# Altium schematic sheet STM32L031.SchDoc: STM32L031 MCU
size A4; DrawnBy: Dheeraj R; DocumentNumber: 4; Revision: 1; SheetNumber: 4; SheetTotal: 5
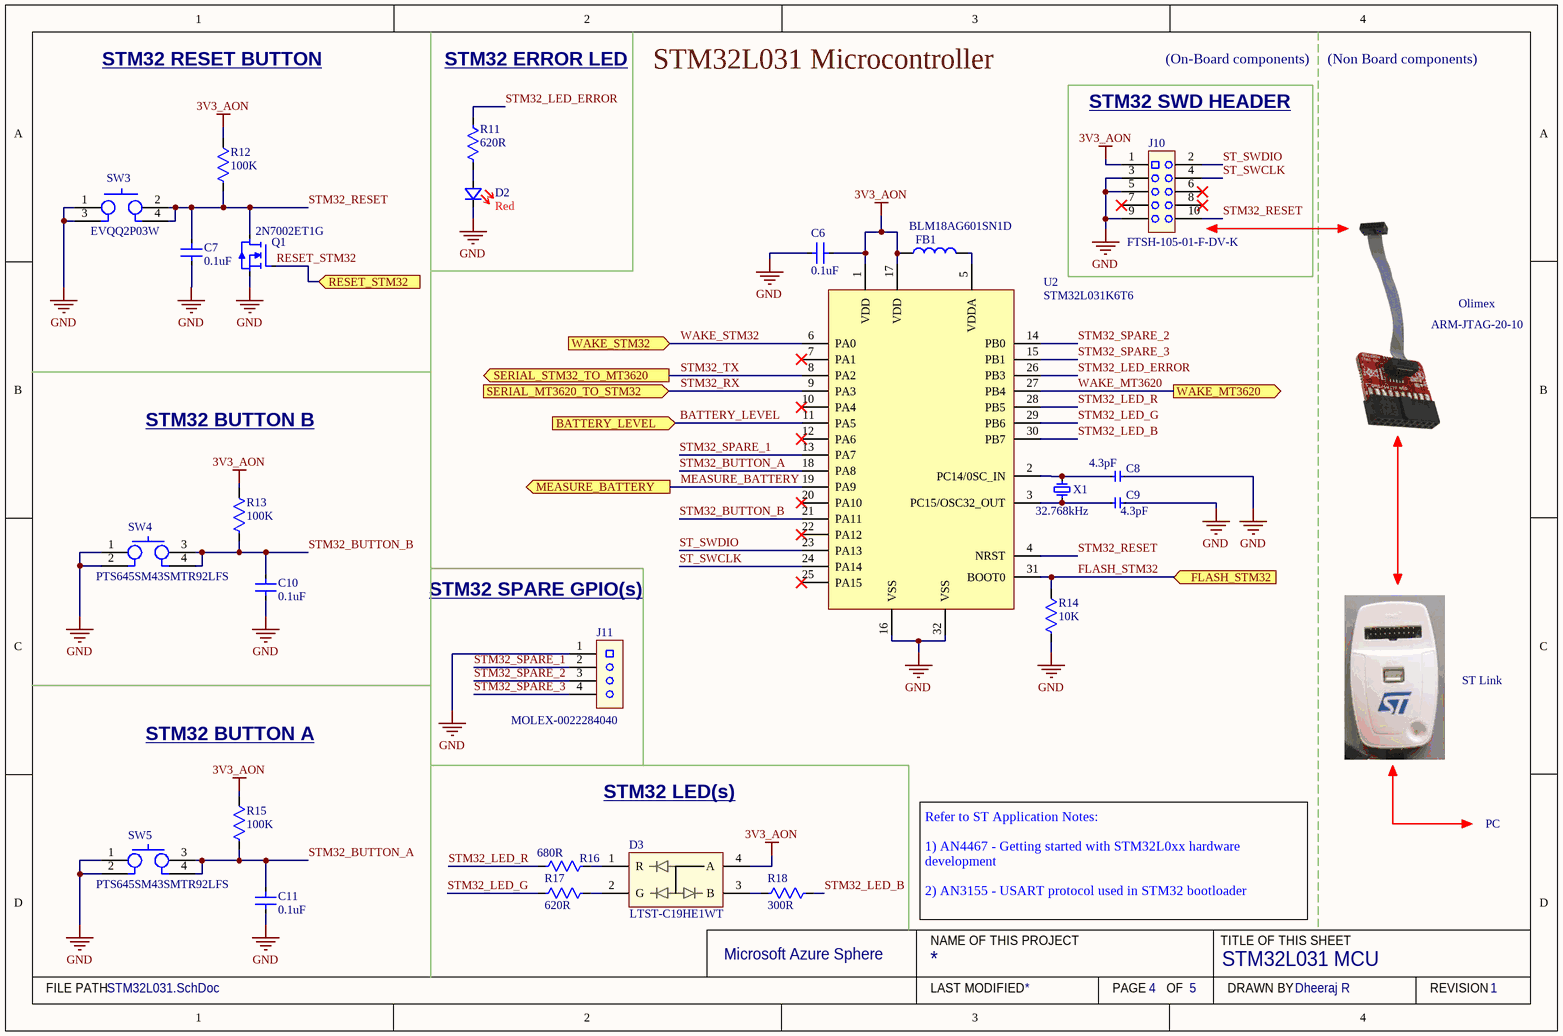
[diagram p0: STM32L031.SchDoc]

## Parts
C6  0.1uF  [CC0603]
C7  0.1uF  [CC0603]
C8  4.3pF  [CAP 0603 (1608) x 1.2mm]
C9  4.3pF  [CAP 0603 (1608) x 1.2mm]
C10  0.1uF  [CC0603]
C11  0.1uF  [CC0603]
D2  Colour: Red  [Rohm SML-D12 Red]  (hidden comment: SML-D12U)
D3  LTST-C19HE1WT  [LTST-C19HE1WT]
FB1  BLM18AG601SN1D  [BLM18P]
J10  FTSH-105-01-F-DV-K  [SAMTEC-FTSH-105-01-X-DV-K]
J11  MOLEX-0022284040  [0022284040]
Q1  2N7002ET1G  [SOT23-ONS]
R11  620R  [RC0603]
R12  100K  [VISHAY-0603]
R13  100K  [VISHAY-0603]
R14  10K  [VISHAY-0603]
R15  100K  [VISHAY-0603]
R16  680R  [RC0603]
R17  620R  [RC0603]
R18  300R  [RC0603]
SW3  SWI TACT SPN0 PANASONIC EVQQ2P03W  [EVQQ2P03W]  (value not drawn)
SW4  PTS645SM43SMTR92LFS  [C&K PTS645SM43SMTR92LFS]
SW5  PTS645SM43SMTR92LFS  [C&K PTS645SM43SMTR92LFS]
U2  STM32L031K6T6  [LQFP32-ST]
X1  32.768kHz  [XTAL_NX3215SA-00]

## Blocks framed on the sheet
STM32 SWD HEADER: J10

## Ports
BATTERY_LEVEL (in), FLASH_STM32 (in), MEASURE_BATTERY (out), RESET_STM32 (in), SERIAL_MT3620_TO_STM32 (in), SERIAL_STM32_TO_MT3620 (out), WAKE_MT3620 (out), WAKE_STM32 (in)

## Nets
3V3_AON: C6.2 D3.4(A) FB1.1 J10.1 R12.2 R13.2 R15.2 U2.1(VDD) U2.17(VDD)
GND: C6.1 C7.1 C8.1 C9.1 C10.1 C11.1 D2.1(K) J10.3 J10.5 J10.9 J11.1 Q1.2 R14.1 SW3.1 SW3.3 SW4.1 SW4.2 SW5.1 SW5.2 U2.16(VSS) U2.32(VSS)
BATTERY_LEVEL: U2.11(PA5) ; port BATTERY_LEVEL
FLASH_STM32: R14.2 U2.31(BOOT0) ; port FLASH_STM32
MEASURE_BATTERY: U2.19(PA9) ; port MEASURE_BATTERY
RESET_STM32: Q1.1 ; port RESET_STM32
ST_SWCLK: J10.4 U2.24(PA14)
ST_SWDIO: J10.2 U2.23(PA13)
STM32_BUTTON_A: C11.2 R15.1 SW5.3 SW5.4 U2.18(PA8)
STM32_BUTTON_B: C10.2 R13.1 SW4.3 SW4.4 U2.21(PA11)
STM32_LED_B: R18.2 U2.30(PB7)
STM32_LED_ERROR: R11.2 U2.26(PB3)
STM32_LED_G: R17.1 U2.29(PB6)
STM32_LED_R: R16.1 U2.28(PB5)
STM32_RESET: C7.2 J10.10 Q1.3 R12.1 SW3.2 SW3.4 U2.4(NRST)
STM32_RX: U2.9(PA3) ; port SERIAL_MT3620_TO_STM32
STM32_SPARE_1: J11.2 U2.13(PA7)
STM32_SPARE_2: J11.3 U2.14(PB0)
STM32_SPARE_3: J11.4 U2.15(PB1)
STM32_TX: U2.8(PA2) ; port SERIAL_STM32_TO_MT3620
WAKE_MT3620: U2.27(PB4) ; port WAKE_MT3620
WAKE_STM32: U2.6(PA0) ; port WAKE_STM32
NetC8_2: C8.2 U2.2(PC14/0SC_IN) X1.1
NetC9_2: C9.2 U2.3(PC15/OSC32_OUT) X1.2
NetD2_2: D2.2(A) R11.1
NetD3_1: D3.1(R) R16.2
NetD3_2: D3.2(G) R17.2
NetD3_3: D3.3(B) R18.1
NetFB1_2: FB1.2 U2.5(VDDA)

Not connected (* = marked no-connect by the designer): J10 6* 7* 8*; U2 7(PA1)* 10(PA4)* 12(PA6)* 20(PA10)* 22(PA12)* 25(PA15)*

## Notes on the sheet
- STM32 RESET BUTTON
- STM32 ERROR LED
- STM32L031 Microcontroller
- (On-Board components)
- (Non Board components)
- Olimex
- ARM-JTAG-20-10
- STM32 BUTTON B
- (near J11) STM32 SPARE GPIO(s)
- ST Link
- STM32 BUTTON A
- STM32 LED(s)
- PC
- Refer to ST Application Notes:
  1) AN4467 - Getting started with STM32L0xx hardware development
  2) AN3155 - USART protocol used in STM32 bootloader
  3) AN2606 - STM32 microcontroller system memory boot mode
- Microsoft Azure Sphere
- NAME OF THIS PROJECT
- TITLE OF THIS SHEET
- FILE PATH
- LAST MODIFIED
- PAGE
- OF
- DRAWN BY
- REVISION

## Library data of the parts
C6 C7 C10 C11 = CC0603KRX7R8BB104: 0.1uF, 0603, CC0603KRX7R8BB104, Yageo, 25V, X7R, 10%, FULL REEL; Capacitance: 100nF; Supplier 1: Digi-Key; Manufacturer: Yageo; Manufacturer Part Number: CC0603KRX7R8BB104; RoHS: Yes; Category: Ceramic Capacitors; Stock 1: 12615855; Pricing 1: 1=0.10000, 10=0.05300, 100=0.02340, 500=0.01674, 1000=0.01316 (USD); Mount: Surface Mount; Case/Package: 0603; Number of Pins: 2; Case Code (Imperial): 0603; Case Code (Metric): 1608; Min Operating Temperature: -55°C; Max Operating Temperature: 125°C; Tolerance: 10%; Dielectric: X7R; Voltage Rating: 25V; Packaging: Tape and Reel; Package Quantity: 1; Voltage Rating (DC): 25V; Termination: SMD/SMT; Composition: Ceramic; Voltage: 25V; Length: 1.6mm; Height: 0.8mm; Width: 0.8mm; Thickness: 0.035inch; Depth: 0.8mm; Radiation Hardening: No; REACH SVHC: Unknown; Lead Free: Lead Free; Halogen Free: Halogen Free; ComponentLink1URL: https://datasheet.ciiva.com/11786/0900766b80c10176-11786120.pdf?src-supplier=RSComponents; ComponentLink1Description: https://datasheet.ciiva.com/11786/0900766b80c10176-11786120.pdf?src-supplier=RSComponents; ComponentLink2URL: https://datasheet.ciiva.com/144/mlccorderingcode-144075.pdf?src-supplier=Digi-Key; ComponentLink2Description: https://datasheet.ciiva.com/144/mlccorderingcode-144075.pdf?src-supplier=Digi-Key; ComponentLink3URL: https://datasheet.ciiva.com/17434/upy-gphc-x7r-6-3v-to-50v-8-17434263.pdf?src-supplier=Avnet+Europe; ComponentLink3Description: https://datasheet.ciiva.com/17434/upy-gphc-x7r-6-3v-to-50v-8-17434263.pdf?src-supplier=Avnet+Europe; ComponentLink4URL: https://datasheet.ciiva.com/26829/getdatasheetpartid-403577-26829431.pdf?src-supplier=Verical; ComponentLink4Description: https://datasheet.ciiva.com/26829/getdatasheetpartid-403577-26829431.pdf?src-supplier=Verical; ComponentLink5URL: https://datasheet.ciiva.com/11587/upy-gphc-x7r-6-3v-to-50v-8-11587208.pdf?src-supplier=Avnet; ComponentLink5Description: https://datasheet.ciiva.com/11587/upy-gphc-x7r-6-3v-to-50v-8-11587208.pdf?src-supplier=Avnet; ComponentLink6URL: https://datasheet.ciiva.com/13389/upy-gphc-x7r-6-3v-to-50v-8-13389352.pdf?src-supplier=Mouser; ComponentLink6Description: https://datasheet.ciiva.com/13389/upy-gphc-x7r-6-3v-to-50v-8-13389352.pdf?src-supplier=Mouser; ComponentLink7URL: https://datasheet.ciiva.com/28450/1489800-28450584.pdf?src-supplier=Element14; ComponentLink7Description: https://datasheet.ciiva.com/28450/1489800-28450584.pdf?src-supplier=Element14; ComponentLink8URL: https://datasheet.ciiva.com/144/mlccorderingcode-144073.pdf?src-supplier=Digi-Key; ComponentLink8Description: https://datasheet.ciiva.com/144/mlccorderingcode-144073.pdf?src-supplier=Digi-Key; ComponentLink9URL: https://datasheet.ciiva.com/144/mlccorderingcode-144074.pdf?src-supplier=Digi-Key; ComponentLink9Description: https://datasheet.ciiva.com/144/mlccorderingcode-144074.pdf?src-supplier=Digi-Key; ComponentLink10URL: https://datasheet.ciiva.com/7978/1489800-7978155.pdf?src-supplier=Element14; ComponentLink10Description: https://datasheet.ciiva.com/7978/1489800-7978155.pdf?src-supplier=Element14; Supplier Part Number 1: 311-1341-1-ND
C8 C9 = 4.3pF 0603 CL10C4R3CB8NNNC: 4.3PF 50V C0G/NP0 0603; Manufacturer: Samsung; Dielectric: C0G; Supplier 1: Digi-Key; Manufacturer Part Number: CL10C4R3CB8NNNC; RoHS: Yes; Category: Ceramic Capacitors; Stock 1: 15793; Pricing 1: 1=0.10000, 10=0.06300, 100=0.02810, 500=0.02010, 1000=0.01579 (USD); Mount: Surface Mount; Case/Package: 0603; Case Code (Metric): 1608; Case Code (Imperial): 0603; Min Operating Temperature: -55°C; Max Operating Temperature: 125°C; Capacitance: 4.3pF; Voltage Rating: 50V; Package Quantity: 1; Packaging: Tape and Reel; Voltage Rating (DC): 50V; Length: 1.6mm; Height: 0.8mm; Width: 0.031inch; Thickness: 0.035inch; Depth: 0.8mm; Radiation Hardening: No; Lead Free: Lead Free; ComponentLink1URL: https://datasheet.ciiva.com/16200/cl10c4r3cb8nnnc-16200048.pdf?src-supplier=Future+Electronics; ComponentLink1Description: https://datasheet.ciiva.com/16200/cl10c4r3cb8nnnc-16200048.pdf?src-supplier=Future+Electronics; ComponentLink2URL: https://datasheet.ciiva.com/25778/cl10c4r3cb8nnnc-25778560.pdf?src-supplier=Digi-Key; ComponentLink2Description: https://datasheet.ciiva.com/25778/cl10c4r3cb8nnnc-25778560.pdf?src-supplier=Digi-Key; ComponentLink3URL: https://datasheet.ciiva.com/26838/getdatasheetpartid-660050-26838544.pdf?src-supplier=Verical; ComponentLink3Description: https://datasheet.ciiva.com/26838/getdatasheetpartid-660050-26838544.pdf?src-supplier=Verical; Supplier Part Number 1: 1276-2309-1-ND
D2 = SML-D12U: 1.6 x 0.8 x 0.55mm (0603) LED 620nm Red; Manufacturer: Rohm Semiconductor; Manufacturer Part Number: SML-D12U8WT86; Millicandela Rating: 63mcd; Voltage - Forward (Vf) (Typ): 2.2V; Current - Test: 20mA; Lens Type: Diffused, White; Lens Style/Size: Rectangle with Flat Top, 1.2mm x 0.8mm; Supplier 1: Digi-Key; RoHS: RoHS Compliant; Category: Optoelectronics; Stock 1: 5722; Pricing 1: 1=0.38, 10=0.279, 25=0.2232, 100=0.1478, 250=0.1046, 500=0.08926, 1000=0.06974 (GBP); Packaging: Cut Tape (CT); Wavelength - Dominant: 620nm; Wavelength - Peak: -; Viewing Angle: -; Package / Case: 0603 (1608 Metric); Size / Dimension: 1.60mm L x 0.80mm W; Height: 0.55mm; Mounting Type: Surface Mount; Luminous Flux @ Current - Test: -; ComponentLink1URL: http://rohmfs.rohm.com/en/products/databook/datasheet/opto/led/chip_mono/sml-d1.pdf; ComponentLink1Description: http://rohmfs.rohm.com/en/products/databook/datasheet/opto/led/chip_mono/sml-d1.pdf; Supplier 2: Farnell; Supplier Part Number 1: 511-1580-1-ND; Supplier Part Number 2: 1685094
D3 = LTST-C19HE1WT: LED RGB DIFFUSED 0606 SMD; Manufacturer: Lite-On Inc.; Color: Red, Green, Blue (RGB); Lens Color: White; Millicandela Rating: 112.5mcd Red, 281mcd Green, 104mcd Blue; Lens Style/Size: Rectangle with Flat Top, 1.15mm x 1.60mm; Voltage - Forward (Vf) (Typ): 2.1V Red, 3.35V Green, 3.35V Blue; Current - Test: 20mA Red, 20mA Green, 20mA Blue; Viewing Angle: 130°; Wavelength - Dominant: 624nm Red, 525nm Green, 470nm Blue; Wavelength - Peak: 632nm Red, 520nm Green, 468nm Blue; Supplier 1: Digi-Key; Manufacturer Part Number: LTST-C19HE1WT; RoHS: RoHS Compliant; Category: Optoelectronics; Stock 1: 464778; Pricing 1: 1=0.45, 10=0.32, 25=0.2616, 100=0.2093, 250=0.17664, 500=0.15048, 1000=0.11776 (GBP); Packaging: Cut Tape (CT); Part Status: Active; Lens Transparency: Diffused; Mounting Type: Surface Mount; Features: -; Package / Case: 0606 (1616 Metric); Supplier Device Package: *; Size / Dimension: 1.60mm L x 1.60mm W; Height (Max): 0.35mm; ComponentLink1URL: http://optoelectronics.liteon.com/upload/download/DS22-2008-0044/S_110_LTST-C19HE1WT.pdf; ComponentLink1Description: http://optoelectronics.liteon.com/upload/download/DS22-2008-0044/S_110_LTST-C19HE1WT.pdf; Supplier Part Number 1: 160-2162-1-ND
FB1 = BLM18AG601SN1D: MURATA - BLM18AG601SN1D - Feritový Korálek, 0603 / 1608, 600 ohm, 500 mA, Série BLM18A, 0.38 ohm, ± 25%; Core Material: Ferrite; Material: Steel,Ferrite; Impedance: 600R; Max Current Rating: 500mA; Number of Lines: 1; DC Resistance (DCR): 380mR; Test Frequency: 100MHz; Shielding: Unshielded; Supplier 1: Digi-Key; Manufacturer: Murata; Manufacturer Part Number: BLM18AG601SN1D; RoHS: Yes; Category: Inductors; Stock 1: 351346; Pricing 1: 1=0.10000, 10=0.07900, 25=0.07200, 50=0.06480, 100=0.04760, 250=0.03460, 500=0.03170, 1000=0.02738 (USD); Case/Package: 0603; Number of Pins: 2; Weight: 7.1E-05oz; Case Code (Metric): 1608; Case Code (Imperial): 0603; Min Operating Temperature: -55°C; Max Operating Temperature: 125°C; Tolerance: 25%; Package Quantity: 1; Packaging: Tape and Reel; Current Rating: 500mA; Termination: SMD/SMT; Max DC Current: 500mA; DC Current: 500mA; Military Standard: Not; Frequency: 100MHz; Number of Circuits: 1; Length: 1.6mm; Height: 0.8mm; Width: 0.8mm; Depth: 0.8mm; Radiation Hardening: No; REACH SVHC: No SVHC; Lead Free: Lead Free; ComponentLink1URL: https://datasheet.ciiva.com/19460/1844766-19460213.pdf?src-supplier=Jameco; ComponentLink1Description: https://datasheet.ciiva.com/19460/1844766-19460213.pdf?src-supplier=Jameco; ComponentLink2URL: https://datasheet.ciiva.com/29347/442309-da-01-en-chip-drossel-0603-600r-500ma-1-6x0-8mm-29347900.pdf?src-supplier=Conrad; ComponentLink2Description: https://datasheet.ciiva.com/29347/442309-da-01-en-chip-drossel-0603-600r-500ma-1-6x0-8mm-29347900.pdf?src-supplier=Conrad; ComponentLink3URL: https://datasheet.ciiva.com/41449/001172228-da-01-en-drossel-0603-600r-1-6x0-8mm-4000st-41449517.pdf?src-supplier=Conrad; ComponentLink3Description: https://datasheet.ciiva.com/41449/001172228-da-01-en-drossel-0603-600r-1-6x0-8mm-4000st-41449517.pdf?src-supplier=Conrad; ComponentLink4URL: https://datasheet.ciiva.com/1012/l0110s0100blm18a-1012017.pdf?src-supplier=Digi-Key; ComponentLink4Description: https://datasheet.ciiva.com/1012/l0110s0100blm18a-1012017.pdf?src-supplier=Digi-Key; ComponentLink5URL: https://datasheet.ciiva.com/1012/l0110s0100blm18a-1012018.pdf?src-supplier=Digi-Key; ComponentLink5Description: https://datasheet.ciiva.com/1012/l0110s0100blm18a-1012018.pdf?src-supplier=Digi-Key; ComponentLink6URL: https://datasheet.ciiva.com/1012/l0110s0100blm18a-1012019.pdf?src-supplier=Digi-Key; ComponentLink6Description: https://datasheet.ciiva.com/1012/l0110s0100blm18a-1012019.pdf?src-supplier=Digi-Key; ComponentLink7URL: https://datasheet.ciiva.com/1466/1756147-1466933.pdf?src-supplier=Element14; ComponentLink7Description: https://datasheet.ciiva.com/1466/1756147-1466933.pdf?src-supplier=Element14; ComponentLink8URL: https://datasheet.ciiva.com/1466/1756147-1466934.pdf?src-supplier=Element14; ComponentLink8Description: https://datasheet.ciiva.com/1466/1756147-1466934.pdf?src-supplier=Element14; ComponentLink9URL: https://datasheet.ciiva.com/16210/l0110s0100blm18a-16210006.pdf?src-supplier=Future+Electronics; ComponentLink9Description: https://datasheet.ciiva.com/16210/l0110s0100blm18a-16210006.pdf?src-supplier=Future+Electronics; ComponentLink10URL: https://datasheet.ciiva.com/3081/l0110s0100blm18a-3081613.pdf?src-supplier=Avnet; ComponentLink10Description: https://datasheet.ciiva.com/3081/l0110s0100blm18a-3081613.pdf?src-supplier=Avnet; Supplier Part Number 1: 490-1014-1-ND
J10 = FTSH-105-01-F-DV-K: CONN HEADER 10POS DUAL .05" SMD; Manufacturer: Samtec Inc.; Connector Type: Header, Unshrouded; Number of Positions: 10; Number of Positions Loaded: All; Pitch: 0.050" (1.27mm); Supplier 1: Digi-Key; Manufacturer Part Number: FTSH-105-01-F-DV-K; RoHS: RoHS Compliant; Category: Connectors, Interconnects; Stock 1: 13304; Pricing 1: 1=2.26, 10=1.907, 50=1.647, 100=1.4737, 250=1.30032, 500=1.21362, 1000=1.12693, 2500=1.08358, 5000=1.06191 (GBP); Packaging: Tube; Contact Type: Male Pin; Number of Rows: 2; Row Spacing: 0.050" (1.27mm); Contact Mating Length: 0.120" (3.05mm); Mounting Type: Surface Mount; Termination: Solder; Fastening Type: -; Features: Keying Shroud; Contact Finish: Gold; Contact Finish Thickness: 3µin (0.08µm); Color: Black; ComponentLink1URL: http://suddendocs.samtec.com/prints/ftsh-1xx-xx-xxx-dv-xxx-mkt.pdf; ComponentLink1Description: http://suddendocs.samtec.com/prints/ftsh-1xx-xx-xxx-dv-xxx-mkt.pdf; Supplier Part Number 1: SAM8796-ND
J11 = MOLEX-0022284040: CONN HEADER 4POS .100 VERT TIN; Manufacturer: Molex, LLC; Connector Type: Header, Unshrouded, Breakaway; Number of Positions: 4; Number of Positions Loaded: All; Pitch: 0.100" (2.54mm); Supplier 1: Digi-Key; Manufacturer Part Number: 0022284040; RoHS: RoHS Compliant; Category: Connectors, Interconnects; Stock 1: 1330; Pricing 1: 1=0.15, 10=0.144, 25=0.1228, 50=0.1074, 100=0.0999, 250=0.08836, 500=0.0845 (GBP); Packaging: Bulk; Contact Type: Male Pin; Number of Rows: 1; Row Spacing: -; Contact Mating Length: 0.240" (6.10mm); Mounting Type: Through Hole; Termination: Solder; Fastening Type: -; Features: -; Contact Finish: Tin; Contact Finish Thickness: 100µin (2.54µm); Color: Black; ComponentLink1URL: http://www.molex.com/pdm_docs/sd/022284040_sd.pdf; ComponentLink1Description: http://www.molex.com/pdm_docs/sd/022284040_sd.pdf; Supplier Part Number 1: WM50014-04-ND
Q1 = 2N7002ET1G: N-CH 60V 0.26A 3-Pin SOT-23 T/R; Manufacturer: ON Semiconductor; Continuous Drain Current (ID): 260mA; Turn-Off Delay Time: 4.8ns; Turn-On Delay Time: 1.7ns; Gate to Source Voltage (Vgs): 20V; Rds On Max: 2.5R; Input Capacitance: 26.7pF; Rise Time: 1.2ns; Max Power Dissipation: 300mW; Element Configuration: Single; Nominal Vgs: 1V; Number of Elements: 1; Supplier 1: Digi-Key; Manufacturer Part Number: 2N7002ET1G; RoHS: Yes; Category: MOSFETs; Stock 1: 23546; Pricing 1: 1=0.18000, 10=0.16300, 25=0.15520, 100=0.06820, 250=0.06548, 500=0.05356, 1000=0.03720 (USD); Case/Package: SOT-23-3; Number of Pins: 3; Min Operating Temperature: -55°C; Max Operating Temperature: 150°C; Package Quantity: 3000; Packaging: Tape and Reel; Fall Time: 1.2ns; Drain to Source Resistance: 2.5R; On-State Resistance: 2.5R; Drain to Source Breakdown Voltage: 60V; Power Dissipation: 300mW; Threshold Voltage: 1V; Length: 2.9mm; Height: 0.94mm; Width: 1.3mm; Radiation Hardening: No; Lead Free: Lead Free; REACH SVHC: No SVHC; Halogen Free: Halogen Free; ComponentLink1URL: https://datasheet.ciiva.com/936/2n7002e-d-936787.pdf?src-supplier=Digi-Key; ComponentLink1Description: https://datasheet.ciiva.com/936/2n7002e-d-936787.pdf?src-supplier=Digi-Key; ComponentLink2URL: https://datasheet.ciiva.com/8059/2n7002e-d-8059427.pdf?src-supplier=Element14; ComponentLink2Description: https://datasheet.ciiva.com/8059/2n7002e-d-8059427.pdf?src-supplier=Element14; ComponentLink3URL: https://datasheet.ciiva.com/13060/2n7002e-d-105476-13060091.pdf?src-supplier=Mouser; ComponentLink3Description: https://datasheet.ciiva.com/13060/2n7002e-d-105476-13060091.pdf?src-supplier=Mouser; ComponentLink4URL: https://datasheet.ciiva.com/936/2n7002e-d-936788.pdf?src-supplier=Digi-Key; ComponentLink4Description: https://datasheet.ciiva.com/936/2n7002e-d-936788.pdf?src-supplier=Digi-Key; ComponentLink5URL: https://datasheet.ciiva.com/936/2n7002e-d-936789.pdf?src-supplier=Digi-Key; ComponentLink5Description: https://datasheet.ciiva.com/936/2n7002e-d-936789.pdf?src-supplier=Digi-Key; ComponentLink6URL: https://datasheet.ciiva.com/3304/2n7002e-d-3304389.pdf?src-supplier=Avnet; ComponentLink6Description: https://datasheet.ciiva.com/3304/2n7002e-d-3304389.pdf?src-supplier=Avnet; ComponentLink7URL: https://datasheet.ciiva.com/3304/2n7002e-d-3304390.pdf?src-supplier=Avnet; ComponentLink7Description: https://datasheet.ciiva.com/3304/2n7002e-d-3304390.pdf?src-supplier=Avnet; ComponentLink8URL: https://datasheet.ciiva.com/15198/getdatasheetpartid-53846-15198758.pdf?src-supplier=Verical; ComponentLink8Description: https://datasheet.ciiva.com/15198/getdatasheetpartid-53846-15198758.pdf?src-supplier=Verical; ComponentLink9URL: https://datasheet.ciiva.com/26146/2n7002e-d-26146200.pdf?src-supplier=Avnet+Europe; ComponentLink9Description: https://datasheet.ciiva.com/26146/2n7002e-d-26146200.pdf?src-supplier=Avnet+Europe; ComponentLink10URL: https://datasheet.ciiva.com/49018/70339334-49018202.pdf?src-supplier=Allied+Electronics; ComponentLink10Description: https://datasheet.ciiva.com/49018/70339334-49018202.pdf?src-supplier=Allied+Electronics; ComponentLink11URL: https://datasheet.ciiva.com/22641/1708226-22641627.pdf?src-supplier=Element14; ComponentLink11Description: https://datasheet.ciiva.com/22641/1708226-22641627.pdf?src-supplier=Element14; ComponentLink12URL: https://datasheet.ciiva.com/16305/2n7002e-d-16305452.pdf?src-supplier=Future+Electronics; ComponentLink12Description: https://datasheet.ciiva.com/16305/2n7002e-d-16305452.pdf?src-supplier=Future+Electronics; ComponentLink13URL: https://datasheet.ciiva.com/22641/1708226-22641628.pdf?src-supplier=Element14; ComponentLink13Description: https://datasheet.ciiva.com/22641/1708226-22641628.pdf?src-supplier=Element14; Supplier Part Number 1: 2N7002ET1GOSCT-ND
R11 R17 = RC0603FR-07620RL: 620 Ohm, 0603, 1% 0.1W(1/10W) 100ppm/ C Molded SMD Paper T/R; Manufacturer: Yageo; Power Rating: 100mW; Voltage Rating: 75V; Temperature Coefficient: 100ppm/°C; Voltage Rating (DC): 50V; Supplier 1: Digi-Key; Manufacturer Part Number: RC0603FR-07620RL; RoHS: Yes; Category: Chip SMD Resistors; Stock 1: 488; Pricing 1: 1=0.10000, 10=0.02300, 100=0.00940, 1000=0.00421, 2500=0.00366 (USD); Case/Package: 0603; Weight: 7.1E-05oz; Case Code (Imperial): 0603; Case Code (Metric): 1608; Min Operating Temperature: -55°C; Max Operating Temperature: 155°C; Resistance: 620R; Tolerance: 1%; Packaging: Tape and Reel; Termination: SMD/SMT; Composition: Thick Film; Military Standard: Not; Length: 1.6mm; Height: 0.45mm; Width: 0.8mm; Depth: 0.8mm; Lead Free: Lead Free; ComponentLink1URL: http://components.arrow.com/part/dataview/0323_00047453?src-supplier=Arrow+Europe; ComponentLink1Description: http://components.arrow.com/part/dataview/0323_00047453?src-supplier=Arrow+Europe; ComponentLink2URL: http://www.mouser.com/ds/2/447/RC0603-272842.pdf?src-supplier=Mouser; ComponentLink2Description: http://www.mouser.com/ds/2/447/RC0603-272842.pdf?src-supplier=Mouser; ComponentLink3URL: http://www.yageo.com/documents/recent/PYu-RC_Group_51_RoHS_L_10.pdf?src-supplier=Digi-Key; ComponentLink3Description: http://www.yageo.com/documents/recent/PYu-RC_Group_51_RoHS_L_10.pdf?src-supplier=Digi-Key; ComponentLink4URL: http://www.yageo.com/documents/recent/PYu-RC0603_51_RoHS_L_7.pdf?src-supplier=Future+Electronics; ComponentLink4Description: http://www.yageo.com/documents/recent/PYu-RC0603_51_RoHS_L_7.pdf?src-supplier=Future+Electronics; ComponentLink5URL: http://www.yageo.com/documents/recent/PYu-RC_Group_51_RoHS_L_9.pdf?src-supplier=Digi-Key; ComponentLink5Description: http://www.yageo.com/documents/recent/PYu-RC_Group_51_RoHS_L_9.pdf?src-supplier=Digi-Key; Supplier Part Number 1: 311-620HRCT-ND
R12 R13 R15 = RC0603FR-07100KL: 100K Ohm 0603 1% 0.1W(1/10W) 100ppm Paper T/R; Manufacturer: Yageo; Resistance: 100kR; Temperature Coefficient: 100ppm/°C; Voltage Rating (DC): 50V; Power Rating: 100mW; Working Voltage: 75V; Supplier 1: Digi-Key; Manufacturer Part Number: RC0603FR-07100KL; RoHS: Yes; Category: Chip SMD Resistors; Stock 1: 18400350; Pricing 1: 1=0.10000, 10=0.02300, 100=0.00940, 1000=0.00421, 2500=0.00366 (USD); Case/Package: 0603; Number of Pins: 2; Case Code (Imperial): 0603; Case Code (Metric): 1608; Min Operating Temperature: -55°C; Max Operating Temperature: 155°C; Tolerance: 1%; Composition: Thick Film; Packaging: Tape and Reel; Voltage Rating: 50V; Termination: SMD/SMT; Military Standard: Not; Number of Terminations: 2; Length: 1.6mm; Height: 0.45mm; Width: 0.8mm; Depth: 0.8mm; REACH SVHC: No SVHC; Lead Free: Lead Free; ComponentLink1URL: https://datasheet.ciiva.com/11808/0900766b80f96399-11808107.pdf?src-supplier=RSComponents; ComponentLink1Description: https://datasheet.ciiva.com/11808/0900766b80f96399-11808107.pdf?src-supplier=RSComponents; ComponentLink2URL: https://datasheet.ciiva.com/7983/443971-7983593.pdf?src-supplier=Element14; ComponentLink2Description: https://datasheet.ciiva.com/7983/443971-7983593.pdf?src-supplier=Element14; ComponentLink3URL: https://datasheet.ciiva.com/46440/1868787-46440889.pdf?src-supplier=Element14; ComponentLink3Description: https://datasheet.ciiva.com/46440/1868787-46440889.pdf?src-supplier=Element14; ComponentLink4URL: https://datasheet.ciiva.com/7746/1738695-7746234.pdf?src-supplier=Element14; ComponentLink4Description: https://datasheet.ciiva.com/7746/1738695-7746234.pdf?src-supplier=Element14; ComponentLink5URL: https://datasheet.ciiva.com/7746/1738695-7746235.pdf?src-supplier=Element14; ComponentLink5Description: https://datasheet.ciiva.com/7746/1738695-7746235.pdf?src-supplier=Element14; ComponentLink6URL: https://datasheet.ciiva.com/22747/443971-22747516.pdf?src-supplier=Element14; ComponentLink6Description: https://datasheet.ciiva.com/22747/443971-22747516.pdf?src-supplier=Element14; Supplier Part Number 1: 311-100KHRCT-ND
R14 = RC0603FR-0710KL: 10K Ohm 0603 1% 1/10W ±100ppm/°C Molded SMD Paper T/R; Manufacturer: Yageo; Resistance: 10kR; Voltage Rating (DC): 50V; Power Rating: 100mW; Voltage Rating: 75V; Supplier 1: Farnell; Manufacturer Part Number: RC0603FR-0710KL; RoHS: Yes; Category: Chip SMD Resistors; Stock 1: 650865; Pricing 1: 10=0.01950, 100=0.01660, 500=0.01160, 1000=0.00890, 2500=0.00660 (GBP); Case/Package: 0603; Number of Pins: 2; Weight: 7.1E-05oz; Case Code (Imperial): 0603; Case Code (Metric): 1608; Min Operating Temperature: -55°C; Max Operating Temperature: 155°C; Tolerance: 1%; Composition: Thick Film; Temperature Coefficient: 100ppm/°C; Packaging: Tape and Reel; Military Standard: Not; Termination: SMD/SMT; Length: 1.6mm; Height: 0.45mm; Width: 0.8mm; Depth: 0.8mm; Lead Pitch: 0.3mm; REACH SVHC: No SVHC; Lead Free: Lead Free; ComponentLink1URL: https://datasheet.ciiva.com/7660/38590-7660789.pdf?src-supplier=Element14; ComponentLink1Description: https://datasheet.ciiva.com/7660/38590-7660789.pdf?src-supplier=Element14; ComponentLink2URL: https://datasheet.ciiva.com/15189/getdatasheetpartid-409289-15189591.pdf?src-supplier=Verical; ComponentLink2Description: https://datasheet.ciiva.com/15189/getdatasheetpartid-409289-15189591.pdf?src-supplier=Verical; ComponentLink3URL: https://datasheet.ciiva.com/46440/1868787-46440891.pdf?src-supplier=Element14; ComponentLink3Description: https://datasheet.ciiva.com/46440/1868787-46440891.pdf?src-supplier=Element14; ComponentLink4URL: https://datasheet.ciiva.com/7983/443971-7983596.pdf?src-supplier=Element14; ComponentLink4Description: https://datasheet.ciiva.com/7983/443971-7983596.pdf?src-supplier=Element14; ComponentLink5URL: https://datasheet.ciiva.com/7746/1738695-7746239.pdf?src-supplier=Element14; ComponentLink5Description: https://datasheet.ciiva.com/7746/1738695-7746239.pdf?src-supplier=Element14; ComponentLink6URL: https://datasheet.ciiva.com/22747/443971-22747519.pdf?src-supplier=Element14; ComponentLink6Description: https://datasheet.ciiva.com/22747/443971-22747519.pdf?src-supplier=Element14; Supplier Part Number 1: 9238603
R16 = RC0603FR-07680RL: 680R, 0603 YAGEO - RC0603FR-07680RL - SMD Chip Resistor, RC Series, 50 V, Thick Film, 100 mW; Tolerance: 1%; Temperature Coefficient: 100ppm/°C; Voltage Rating (DC): 50V; Power Rating: 100mW; Supplier 1: Digi-Key; Manufacturer: Yageo; Manufacturer Part Number: RC0603FR-07680RL; RoHS: Yes; Category: Chip SMD Resistors; Stock 1: 2382438; Pricing 1: 1=0.10000, 10=0.02300, 100=0.00940, 1000=0.00421, 2500=0.00366 (USD); Case/Package: 0603; Number of Pins: 2; Case Code (Imperial): 0603; Case Code (Metric): 1608; Min Operating Temperature: -55°C; Max Operating Temperature: 155°C; Resistance: 680R; Composition: Thick Film; Packaging: Tape and Reel; Number of Terminations: 2; Military Standard: Not; Voltage Rating: 50V; Package Quantity: 1; Max Power Dissipation: 100mW; Features: Moisture Resistant; Termination: SMD/SMT; Length: 1.6mm; Height: 0.022inch; Width: 0.031inch; Depth: 0.8mm; REACH SVHC: No SVHC; Lead Free: Lead Free; ComponentLink1URL: https://datasheet.ciiva.com/2553/pyu-r-int-thick-7-2553546.pdf?src-supplier=Digi-Key; ComponentLink1Description: https://datasheet.ciiva.com/2553/pyu-r-int-thick-7-2553546.pdf?src-supplier=Digi-Key; ComponentLink2URL: https://datasheet.ciiva.com/7746/443971-7746389.pdf?src-supplier=Element14; ComponentLink2Description: https://datasheet.ciiva.com/7746/443971-7746389.pdf?src-supplier=Element14; ComponentLink3URL: https://datasheet.ciiva.com/46412/443971-46412854.pdf?src-supplier=Element14; ComponentLink3Description: https://datasheet.ciiva.com/46412/443971-46412854.pdf?src-supplier=Element14; ComponentLink4URL: https://datasheet.ciiva.com/2553/pyu-r-int-thick-7-2553545.pdf?src-supplier=Digi-Key; ComponentLink4Description: https://datasheet.ciiva.com/2553/pyu-r-int-thick-7-2553545.pdf?src-supplier=Digi-Key; ComponentLink5URL: https://datasheet.ciiva.com/2553/pyu-r-int-thick-7-2553547.pdf?src-supplier=Digi-Key; ComponentLink5Description: https://datasheet.ciiva.com/2553/pyu-r-int-thick-7-2553547.pdf?src-supplier=Digi-Key; Supplier Part Number 1: 311-680HRCT-ND
R18 = RC0603FR-07300RL: 300 Ohm, 0603, 1% 0.1W(1/10W) 100ppm/ C Molded SMD Paper T/R; Manufacturer: Yageo; Power Rating: 100mW; Voltage Rating: 50V; Temperature Coefficient: 100ppm/°C; Working Voltage: 75V; Supplier 1: Digi-Key; Manufacturer Part Number: RC0603FR-07300RL; RoHS: Yes; Category: Chip SMD Resistors; Stock 1: 798546; Pricing 1: 1=0.10000, 10=0.02300, 100=0.00940, 1000=0.00421, 2500=0.00366 (USD); Case/Package: 0603; Number of Pins: 2; Case Code (Imperial): 0603; Case Code (Metric): 1608; Min Operating Temperature: -55°C; Max Operating Temperature: 155°C; Resistance: 300R; Tolerance: 1%; Package Quantity: 1; Packaging: Tape and Reel; Termination: SMD/SMT; Composition: Thick Film; Number of Terminations: 2; Military Standard: Not; Max Power Dissipation: 100mW; Voltage Rating (DC): 50V; Features: Moisture Resistant; Length: 1.6mm; Height: 0.022inch; Width: 0.8mm; Depth: 0.8mm; REACH SVHC: Unknown; Lead Free: Lead Free; ComponentLink1URL: https://datasheet.ciiva.com/2454/pyu-r-int-thick-7-2454627.pdf?src-supplier=Digi-Key; ComponentLink1Description: https://datasheet.ciiva.com/2454/pyu-r-int-thick-7-2454627.pdf?src-supplier=Digi-Key; ComponentLink2URL: https://datasheet.ciiva.com/2454/pyu-r-int-thick-7-2454628.pdf?src-supplier=Digi-Key; ComponentLink2Description: https://datasheet.ciiva.com/2454/pyu-r-int-thick-7-2454628.pdf?src-supplier=Digi-Key; ComponentLink3URL: https://datasheet.ciiva.com/2454/pyu-r-int-thick-7-2454629.pdf?src-supplier=Digi-Key; ComponentLink3Description: https://datasheet.ciiva.com/2454/pyu-r-int-thick-7-2454629.pdf?src-supplier=Digi-Key; ComponentLink4URL: https://datasheet.ciiva.com/46395/443971-46395002.pdf?src-supplier=Element14; ComponentLink4Description: https://datasheet.ciiva.com/46395/443971-46395002.pdf?src-supplier=Element14; Supplier Part Number 1: 311-300HRCT-ND
SW3 = SWI TACT SPN0 PANASONIC EVQQ2P03W: PANASONIC - EVQQ2P03W - SWITCH, SPNO, SMD; Switch Function Type: SPST Push; Max Contact Voltage AC: 250; Max Contact Voltage DC: 15; Max Contact Current DC: 20; Supplier 1: Farnell; Manufacturer: PANASONIC; RoHS: YES; Category: Switches & Relays; Stock 1: 3989; Pricing 1: 1=0.38, 50=0.29, 100=0.23 (GBP); Series: EVQQ2; Contact Configuration: SPNO; Terminal Type: SMD; ComponentLink1URL: http://www.farnell.com/datasheets/28111.pdf; ComponentLink1Description: http://www.farnell.com/datasheets/28111.pdf; Supplier Part Number 1: 9962859RL; Manufacturer Part Number: EVQQ2P03W
SW4 SW5 = PTS645SM43SMTR92LFS: SWITCH TACTILE SPST-NO 0.05A 12V; Manufacturer: ITT C&K; Mechanical Life: 100000Cycles; Actuator Material: Nylon,Polyamide; Throw Configuration: SPST; Operating Force: 160gf; Contact Resistance: 100mR; Max Current Rating: 50mA; Illumination Type: Non-Illuminated,Illuminated; Switch Function: Off-Mom; Actuator Type: Standard; Actuator Length: 0.85mm; Supplier 1: Digi-Key; Manufacturer Part Number: PTS645SM43SMTR92LFS; RoHS: Yes; Category: Tactile Switches; Stock 1: 233515; Pricing 1: 1=0.28000, 10=0.26600, 25=0.25240, 100=0.22860, 250=0.20840, 500=0.19372 (USD); Mount: Surface Mount; Case/Package: SMD/SMT; Contact Plating: Silver; Contact Material: Silver; Color: Black; Min Operating Temperature: -20°C; Max Operating Temperature: 60°C; Max Voltage Rating (DC): 12V; Packaging: Tape and Reel; Termination: Gull Wing; Package Quantity: 1; Current Rating: 50mA; Voltage Rating (DC): 12V; Orientation: Straight; Length: 6mm; Depth: 9mm; Lead Free: Lead Free; REACH SVHC: No SVHC; ComponentLink1URL: https://datasheet.ciiva.com/29903/getdatasheetpartid-786341-29903846.pdf?src-supplier=Verical; ComponentLink1Description: https://datasheet.ciiva.com/29903/getdatasheetpartid-786341-29903846.pdf?src-supplier=Verical; ComponentLink2URL: https://datasheet.ciiva.com/29931/getdatasheetpartid-764615-29931183.pdf?src-supplier=Verical; ComponentLink2Description: https://datasheet.ciiva.com/29931/getdatasheetpartid-764615-29931183.pdf?src-supplier=Verical; ComponentLink3URL: https://datasheet.ciiva.com/14920/pts645-14920733.pdf?src-supplier=Digi-Key; ComponentLink3Description: https://datasheet.ciiva.com/14920/pts645-14920733.pdf?src-supplier=Digi-Key; ComponentLink4URL: https://datasheet.ciiva.com/14920/pts645-14920734.pdf?src-supplier=Digi-Key; ComponentLink4Description: https://datasheet.ciiva.com/14920/pts645-14920734.pdf?src-supplier=Digi-Key; ComponentLink5URL: https://datasheet.ciiva.com/14920/pts645-14920735.pdf?src-supplier=Digi-Key; ComponentLink5Description: https://datasheet.ciiva.com/14920/pts645-14920735.pdf?src-supplier=Digi-Key; Supplier Part Number 1: CKN9112CT-ND
U2 = STM32L031K6T6: IC MCU 32BIT 32KB FLASH 32LQFP; Manufacturer: STMicroelectronics; Interface: I2C,SPI,UART; Peripherals: Brown-out Detect/Reset,POR,PWM,WDT,DMA; Core Architecture: ARM; Frequency: 32MHz; Number of I/Os: 38; Oscillator Type: Internal; Data Bus Width: 32b; RAM Size: 8KB; Number of ADC Channels: 10; Max Supply Voltage: 3.6V; Min Supply Voltage: 1.65V; Supplier 1: Digi-Key; Manufacturer Part Number: STM32L031K6T6; RoHS: No; Category: Microcontrollers; Stock 1: 2601; Pricing 1: 1=2.86000, 10=2.56800, 25=2.42240, 100=2.06400, 250=1.93800, 500=1.69576, 1000=1.40505, 2500=1.30815, 5000=1.25970 (USD); Case/Package: LQFP; Min Operating Temperature: -40°C; Max Operating Temperature: 85°C; Memory Type: FLASH; Packaging: Tray; Memory Size: 32KB; Max Frequency: 32MHz; Package Quantity: 1500; ComponentLink1URL: https://datasheet.ciiva.com/70238/en-dm00140359-70238919.pdf?src-supplier=Digi-Key; ComponentLink1Description: https://datasheet.ciiva.com/70238/en-dm00140359-70238919.pdf?src-supplier=Digi-Key; Supplier Part Number 1: 497-17486-ND
X1 = NX3215SA-32.768KHZ-EXS00A-MU00525: CRYSTAL 32.768KHZ 6PF SMD; Manufacturer: NDK; ESR (Equivalent Series Resistance): 70kR; Supplier 1: Digi-Key; Manufacturer Part Number: NX3215SA-32.768KHZ-EXS00A-MU00525; RoHS: No; Stock 1: 6963; Pricing 1: 1=0.68000, 10=0.60200, 50=0.56280, 100=0.49740, 500=0.47124, 1000=0.39270 (USD); Mount: Surface Mount; Case/Package: SMD/SMT; Min Operating Temperature: -40°C; Max Operating Temperature: 85°C; Packaging: Tape and Reel; Frequency: 32.768kHz; Load Capacitance: 6pF; Ratings: AEC-Q200; Supplier Part Number 1: 644-1386-1-ND